# EAGLE schematic untitled (EAGLE 8.0.1)
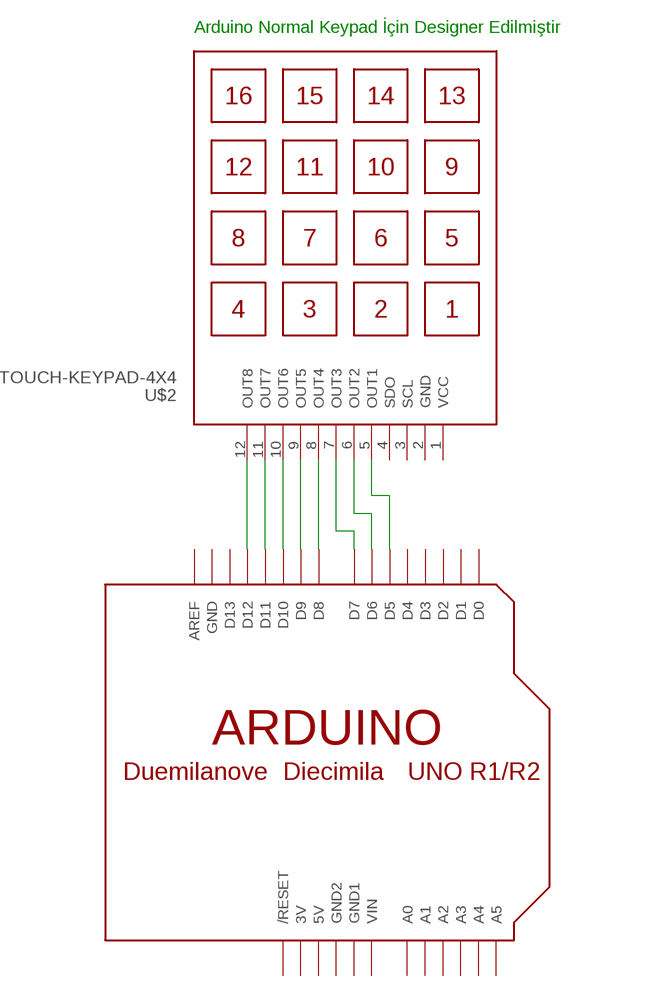
[diagram p0: schematic, sheet 1]

## Parts
U$1  ARDUINOUNO  [ARDUINO]
U$2  TOUCH-KEYPAD-4X4  [TOUCH-KEYPAD-4X4]

## Nets
N$1: U$1.D12 U$2.12(OUT8)
N$2: U$1.D11 U$2.11(OUT7)
N$3: U$1.D10 U$2.10(OUT6)
N$4: U$1.D9 U$2.9(OUT5)
N$5: U$1.D8 U$2.8(OUT4)
N$6: U$1.D7 U$2.7(OUT3)
N$7: U$1.D6 U$2.6(OUT2)
N$8: U$1.D5 U$2.5(OUT1)
Unconnected: U$1.A0 U$1.A1 U$1.A2 U$1.A3 U$1.A4 U$1.A5 U$1.AREF U$1.D0 U$1.D1 U$1.D2 U$1.D3 U$1.D4 U$1.D13 U$1.RESET(/RESET) U$2.3(SCL) U$2.4(SDO)

## Notes on the sheet
- Arduino Normal Keypad İçin Designer Edilmiştir

## Power pins joined to a net without a drawn wire
3V: U$1.3V
5V: U$1.5V
GND: U$1.GND U$2.2(GND)
GND1: U$1.GND1
GND2: U$1.GND2
VCC: U$2.1(VCC)
VIN: U$1.VIN

## Library data of the parts
U$1 = adafruit:ARDUINO: Arduino Diecimila/Duemilanove Make a shield with ease, this package has all the named pins as well as the two mounting drill holes and an outline of the USB and DC power connector. The outline is on the DIMENSION layer, so if your board house uses it they will cut the outline to match. http://www.ladyada.net/library/pcb/eaglelibrary.html
U$2 = diy-modules:TOUCH-KEYPAD-4X4: 16 Channel Capacitive Touch Keypad Click here to find device on ebay.com <http://www.ebay.com/sch/ttp229+16+channel+digital+capacitive+touch+sensor>